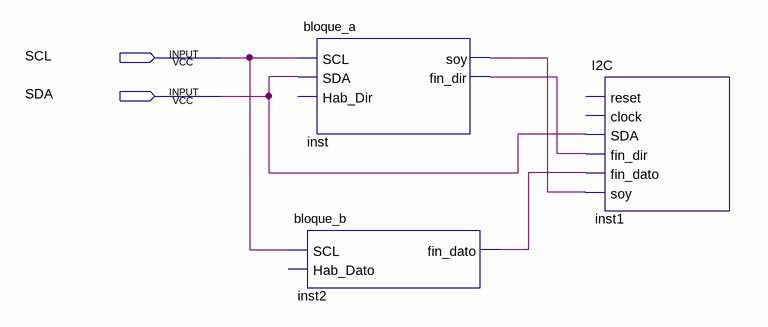
[diagram p0: schematic sheet]
// Quartus schematic I2C_FINAL.bdf as structural Verilog: 3 symbols, 2 pins
module I2C_FINAL (
  input  SCL,
  input  SDA
);

  wire inst2_fin_dato, inst_fin_dir, inst_soy;

  bloque_a inst (.SCL(SCL), .SDA(SDA), .soy(inst_soy), .fin_dir(inst_fin_dir));  // open: Hab_Dir
  bloque_b inst2 (.SCL(SCL), .fin_dato(inst2_fin_dato));  // open: Hab_Dato
  I2C inst1 (.SDA(SDA), .fin_dir(inst_fin_dir), .fin_dato(inst2_fin_dato), .soy(inst_soy));  // open: reset, clock
endmodule
